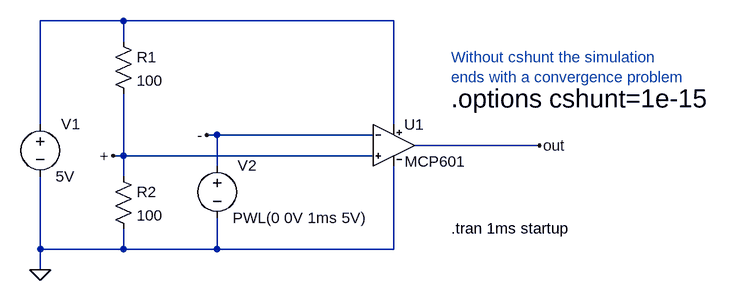
[diagram p0: schematic MCP601-jig.asc]
MCP601-jig.asc, the LTspice schematic file:
Version 4
SHEET 1 2096 4288
WIRE -144 -16 -272 -16
WIRE 272 -16 -144 -16
WIRE -144 16 -144 -16
WIRE -272 144 -272 -16
WIRE 272 144 272 -16
WIRE 0 160 -16 160
WIRE 240 160 0 160
WIRE 496 176 304 176
WIRE -144 192 -144 96
WIRE -144 192 -160 192
WIRE 240 192 -144 192
WIRE 0 208 0 160
WIRE -144 224 -144 192
WIRE -272 336 -272 224
WIRE -144 336 -144 304
WIRE -144 336 -272 336
WIRE 0 336 0 288
WIRE 0 336 -144 336
WIRE 272 336 272 208
WIRE 272 336 0 336
WIRE -272 368 -272 336
FLAG -272 368 0
FLAG -160 192 +
FLAG -16 160 -
FLAG 496 176 out
SYMBOL voltage -272 128 R0
WINDOW 0 32 15 Left 2
WINDOW 123 0 0 Left 2
WINDOW 39 0 0 Left 2
SYMATTR InstName V1
SYMATTR Value 5V
SYMBOL voltage 0 192 R0
WINDOW 0 32 15 Left 2
WINDOW 123 0 0 Left 2
WINDOW 39 0 0 Left 2
SYMATTR InstName V2
SYMATTR Value PWL(0 0V 1ms 5V)
SYMBOL res -160 0 R0
SYMATTR InstName R1
SYMATTR Value 100
SYMBOL res -160 208 R0
SYMATTR InstName R2
SYMATTR Value 100
SYMBOL _PERSONAL\\opamps\\MCP601 272 112 R0
SYMATTR InstName U1
TEXT 360 304 Left 2 !.tran 1ms startup
TEXT 360 104 Left 4 !.options cshunt=1e-15
TEXT 360 40 Left 2 ;Without cshunt the simulation \nends with a convergence problem

The netlist it stands for:
* MCP601-jig.asc
V1 N001 0 5V
V2 - 0 PWL(0 0V 1ms 5V)
R1 N001 + 100
R2 + 0 100
XU1 + - N001 0 out MCP601 MCP601 MCP601  ; pins In+ In- V+ V- OUT
.tran 1ms startup
.options cshunt=1e-15
* Without cshunt the simulation
* ends with a convergence problem
.lib ..\sym\_PERSONAL\opamps\MCP601.sub
.backanno
.end